# EAGLE design zdrive (EAGLE 9.6.2)
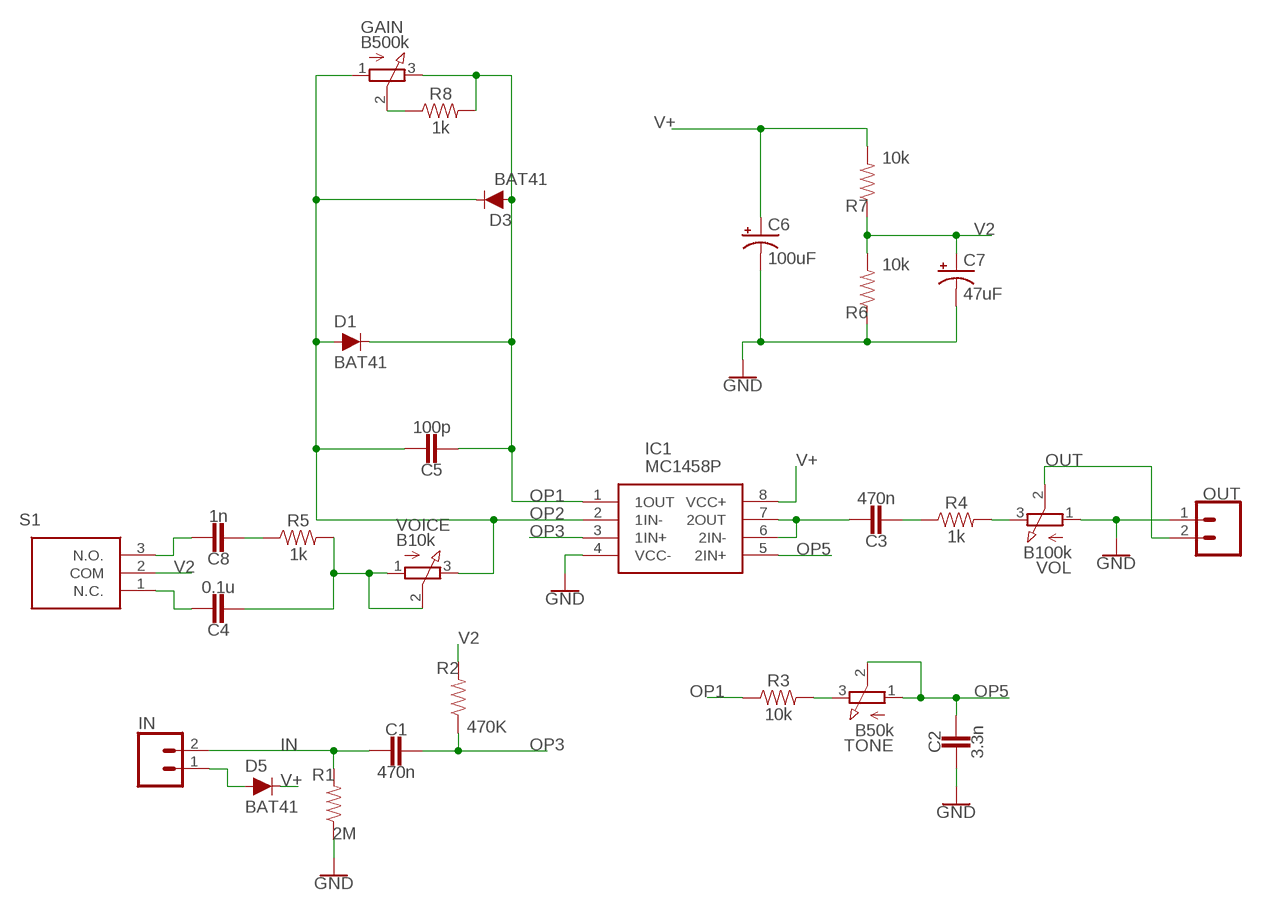
[diagram p0: schematic, sheet 1]

## Parts
C1  470n  CAP.5  [.33UF+]
C2  3.3n  CAP.5  [.33UF+]
C3  470n  CAP.5  [.33UF+]
C4  0.1u  CAP.5  [.33UF+]
C5  100p  CAP.5  [.33UF+]
C6  100uF  100UF-POLAR-RADIAL-2.5MM-25V-20%  [CPOL-RADIAL-2.5MM-6.5MM]
C7  47uF  47UF-POLAR-RADIAL-2.5MM-25V-20%  [CPOL-RADIAL-2.5MM-6.5MM]
C8  1n  CAP.5  [.33UF+]
D1  BAT41  DIODE-KIT2  [DIODE-1N4001-KIT]
D3  BAT41  DIODE-KIT2  [DIODE-1N4001-KIT]
D5  BAT41  DIODE-KIT2  [DIODE-1N4001-KIT]
GAIN  B500k  16MMPOT  [3RP/1610N]
IC1  MC1458P  [DIP794W53P254L959H508Q8N]
IN  CONN_02  [1X02]
OUT  CONN_02  [1X02]
R1  2M  2MOHM-HORIZ-1/4W-5%  [AXIAL-0.3]
R2  470K  470K-HORIZ-1/4W-5%  [AXIAL-0.3]
R3  10k  10KOHM-HORIZ-1/4W-5%  [AXIAL-0.3]
R4  1k  1KOHM-HORIZ-1/4W-5%  [AXIAL-0.3]
R5  1k  1KOHM-HORIZ-1/4W-5%  [AXIAL-0.3]
R6  10k  10KOHM-HORIZ-1/4W-5%  [AXIAL-0.3]
R7  10k  10KOHM-HORIZ-1/4W-5%  [AXIAL-0.3]
R8  1k  1KOHM-HORIZ-1/4W-5%  [AXIAL-0.3]
S1  100SP1T1B2M2QE  [100SP1T1B4M2QE]
TONE  B50k  16MMPOT  [3RP/1610N]
VOICE  B10k  16MMPOT  [3RP/1610N]
VOL  B100k  16MMPOT  [3RP/1610N]

## Nets
9V: D5.A IN.1
GND: C2.2 C6.2(-) C7.2(-) IC1.4(VCC-) OUT.1 R1.P$1 R6.P$1 VOL.1(A)
IN: C1.2 IN.2 R1.P$2
N$1: R3.P$2 TONE.3(E)
N$2: C3.1 IC1.6(2IN-) IC1.7(2OUT)
N$3: C3.2 R4.P$1
N$4: R4.P$2 VOL.3(E)
N$5: GAIN.2(S) R8.P$1
N$6: C8.2 R5.P$1
N$11: C4.1 S1.1(N.C.)
N$12: C8.1 S1.3(N.O.)
N$13: C4.2 R5.P$2 VOICE.1(A) VOICE.2(S)
OP1: C5.2 D1.C D3.A GAIN.3(E) IC1.1(1OUT) R3.P$1 R8.P$2
OP2: C5.1 D1.A D3.C GAIN.1(A) IC1.2(1IN-) VOICE.3(E)
OP3: C1.1 IC1.3(1IN+) R2.P$1
OP5: C2.1 IC1.5(2IN+) TONE.1(A) TONE.2(S)
OUT: OUT.2 VOL.2(S)
V2: C7.1(+) R2.P$2 R6.P$2 R7.P$1 S1.2(COM)
V+: C6.1(+) D5.C IC1.8(VCC+) R7.P$2

## Library data of the parts
C1-C5 C8 = capacitors-film:CAP: For Ceramic, Film, MLCC caps
C6 = SparkFun-Capacitors:100UF-POLAR: 100µF polarized capacitors A capacitor is a passive two-terminal electrical component used to store electrical energy temporarily in an electric field.; PROD_ID: CAP-08439
C7 = Custom-Parts:47UF-POLAR: 47µF polarized capacitors A capacitor is a passive two-terminal electrical component used to store electrical energy temporarily in an electric field.; PROD_ID: CAP-08439
D1 D3 D5 = SparkFun-DiscreteSemi:DIODE: Diode These are standard reverse protection diodes and small signal diodes. SparkFun Products: SparkFun SparkPunk Sound Kit <https://www.sparkfun.com/products/11177> SparkFun ESP8266 Thing <https://www.sparkfun.com/products/13231>; PROD_ID: DIO-09176; VALUE: 1A/50V/1.1V
GAIN TONE VOICE VOL = Custom-Parts:16MMPOT: 16mm Potentiometer one level Source: http://www.alphapotentiometers.net/html/16mm_pot_2.html
IC1 = SamacSys_Parts:MC1458P: General usage dual op-amp,MC1458P DIP8 Texas Instruments MC1458P, Dual Op Amp, 1MHz, 8-Pin PDIP Source: Datasheet <http://www.ti.com/lit/ds/symlink/mc1458.pdf>; DESCRIPTION: General usage dual op-amp,MC1458P DIP8 Texas Instruments MC1458P, Dual Op Amp, 1MHz, 8-Pin PDIP; HEIGHT: 5.08mm; MANUFACTURER_NAME: Texas Instruments; MANUFACTURER_PART_NUMBER: MC1458P; MOUSER_PART_NUMBER: 595-MC1458P; MOUSER_PRICE-STOCK: https://www.mouser.co.uk/ProductDetail/Texas-Instruments/MC1458P?qs=YhsVCygOPE1MedllaWxE%252BA%3D%3D
IN OUT = SparkFun-Connectors:CONN_02: Multi connection point. Often used as Generic Header-pin footprint for 0.1 inch spaced/style header connections On any of the 0.1 inch spaced packages, you can populate with these: Break Away Headers - Straight <https://www.sparkfun.com/products/116> (PRT-00116) Break Away Male Headers - Right Angle <https://www.sparkfun.com/products/553> (PRT-00553) Female Headers <https://www.sparkfun.com/products/115> (PRT-00115) Break Away Headers - Machine Pin <https://www.sparkfun.com/products/117> (PRT-00117) Break Away Female Headers - Swiss Machine Pin <https://www.sparkfun.com/products/743> (PRT-00743) For SCREWTERMINALS and SPRING TERMINALS visit here: Screw Terimnals on SparkFun.com <https://www.sparkfun.com/search/results?term=Screw+Terminals> (5mm/3.5mm/2.54mm spacing) This device is also useful as a general connection point to wire up your design to another part of your project. Our various solder wires solder well into these plated through hole pads. Hook-Up Wire - Assortment (Stranded, 22 AWG) <https://www.sparkfun.com/products/11375> (PRT-11375) Hook-Up Wire - Assortment (Solid Core, 22 AWG) <https://www.sparkfun.com/products/11367> (PRT-11367) View the entire wire category on our website here <https://www.sparkfun.com/categories/141> Special notes: Molex polarized connector foot print use with: PRT-08233 with associated crimp pins and housings. 2.54_SCREWTERM for use with PRT-10571. 3.5mm Screw Terminal footprints for PRT-08084 5mm Screw Terminal footprints for use with PRT-08432
R1 = Custom-Parts:2MOHM: 2MΩ resistor A resistor is a passive two-terminal electrical component that implements electrical resistance as a circuit element. Resistors act to reduce current flow, and, at the same time, act to lower voltage levels within circuits. - Wikipedia; PROD_ID: RES-09329
R2 = Custom-Parts:470K: 470KΩ resistor A resistor is a passive two-terminal electrical component that implements electrical resistance as a circuit element. Resistors act to reduce current flow, and, at the same time, act to lower voltage levels within circuits. - Wikipedia; PROD_ID: RES-09329
R3 R6 R7 = SparkFun-Resistors:10KOHM: 10kΩ resistor A resistor is a passive two-terminal electrical component that implements electrical resistance as a circuit element. Resistors act to reduce current flow, and, at the same time, act to lower voltage levels within circuits. - Wikipedia; PROD_ID: RES-09435
R4 R5 R8 = SparkFun-Resistors:1KOHM: 1kΩ resistor A resistor is a passive two-terminal electrical component that implements electrical resistance as a circuit element. Resistors act to reduce current flow, and, at the same time, act to lower voltage levels within circuits. - Wikipedia; PROD_ID: RES-08380
S1 = SamacSys_Parts:100SP1T1B2M2QE: Toggle Switches 5A 120VAC/28VDC On-None-On PC Mnt Source: Datasheet <https://www.e-switch.com/system/asset/product_line/data_sheet/129/100.pdf>; DESCRIPTION: Toggle Switches 5A 120VAC/28VDC On-None-On PC Mnt; HEIGHT: 28mm; MANUFACTURER_NAME: E-Switch; MANUFACTURER_PART_NUMBER: 100SP1T1B2M2QE; MOUSER_PART_NUMBER: 612-100SP1T1B2M2QE; MOUSER_PRICE-STOCK: https://www.mouser.co.uk/ProductDetail/E-Switch/100SP1T1B2M2QE?qs=f57gQzlyLipVPLzNFzaEDQ%3D%3D

## Board
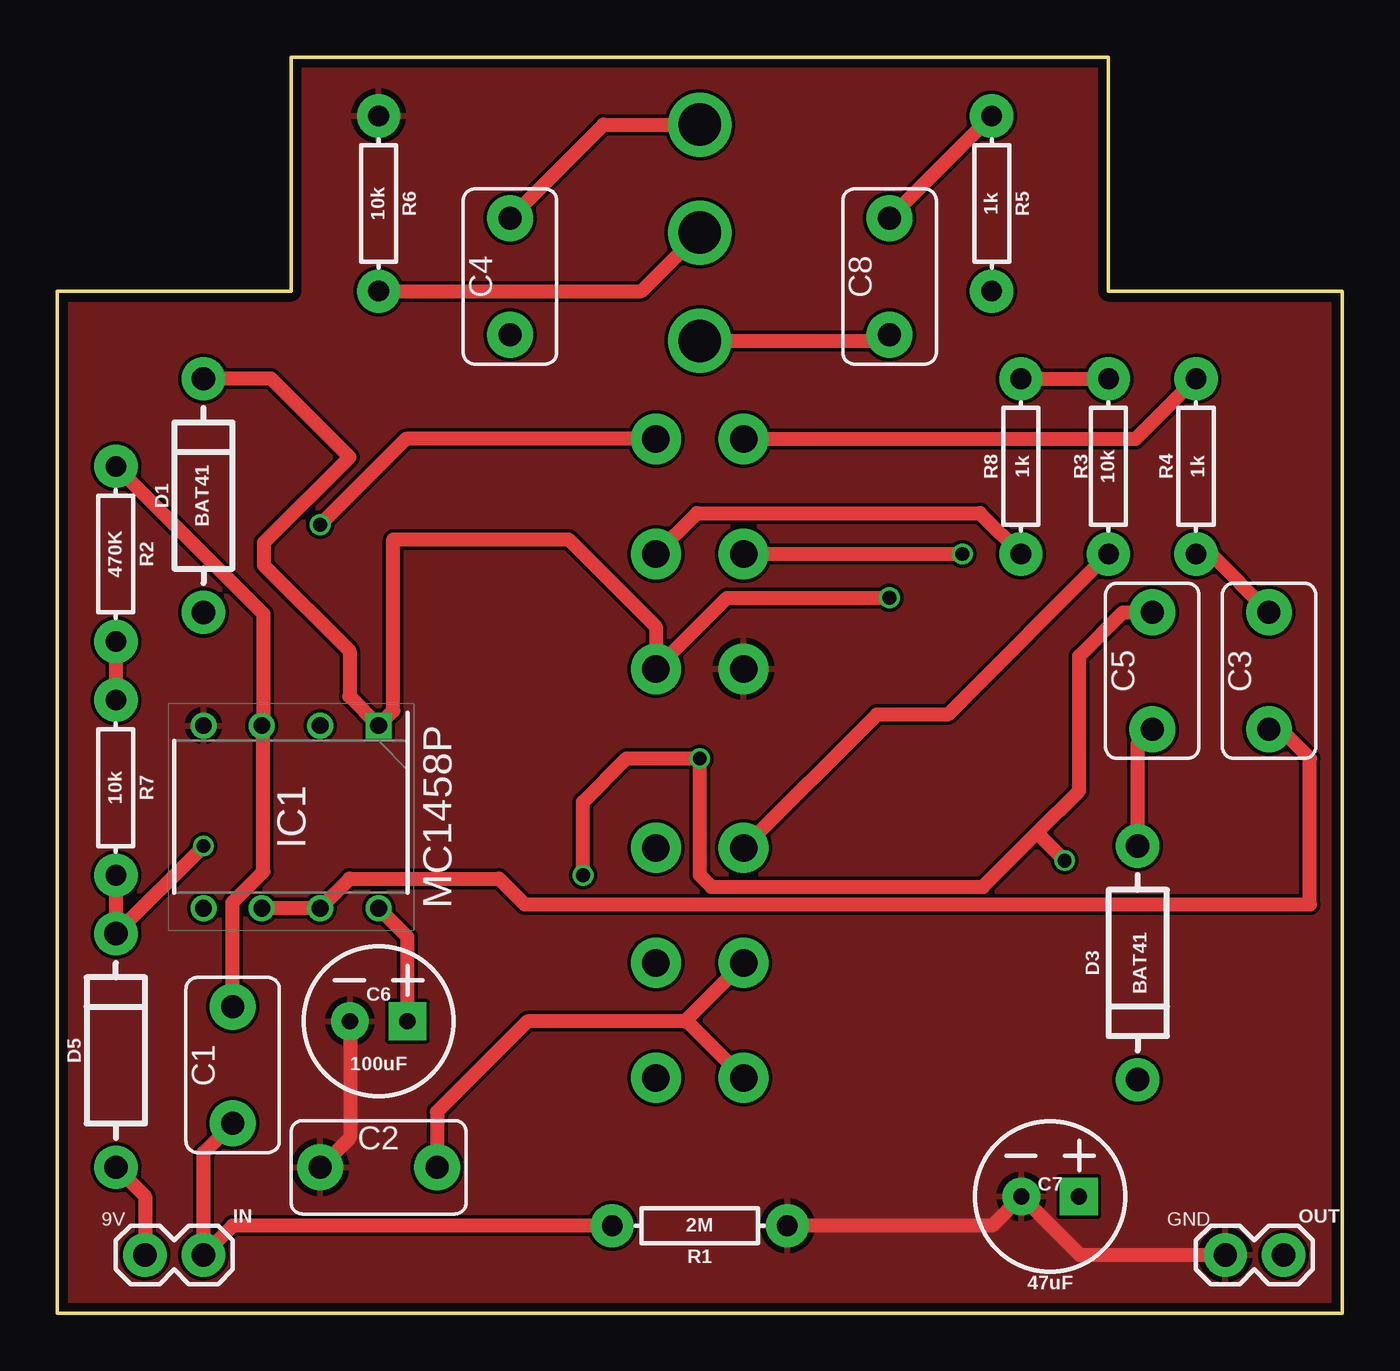
[diagram p1: board, top side]
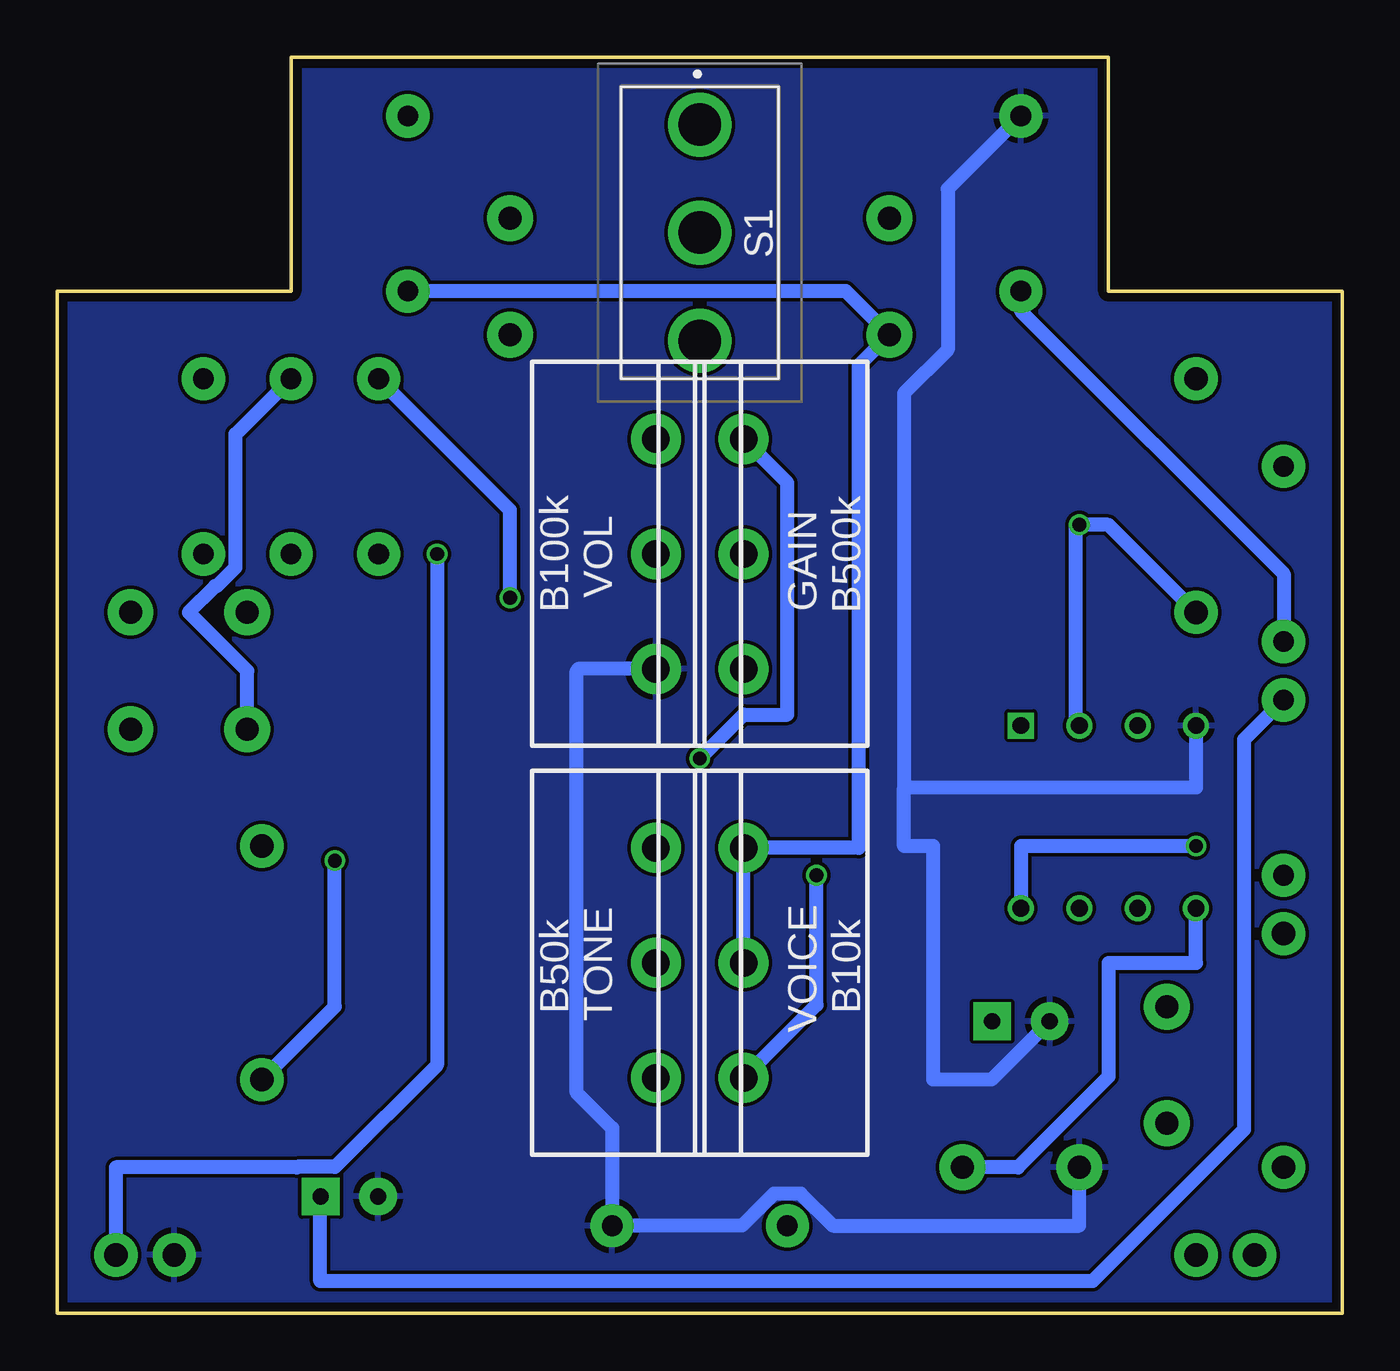
[diagram p2: board, bottom side, seen from below]

Size 55.88 x 54.61 mm. Coordinates in mm from the lower left corner, seen from the top.
Outline: 0,44.45 10.16,44.45 10.16,54.61 45.72,54.61 45.72,44.45 55.88,44.45 55.88,0 0,0 0,44.45
Copper layers (1*16): Top 0.035559375mm / dielectric 1.6mm / Bottom 0.035559375mm
Design rules "oshpark-2layer": minimum track width 6mil, minimum drill 10mil, track to track 6mil, track to pad 6mil, pad to pad 6mil, via to via 6mil, smd to smd 6mil, copper to edge 15mil, drill to drill 6mil, minimum pad ring 5mil, minimum via ring 5mil, stop-mask expansion 2.5mil, vias tented up to drill 0mil, thermal gap 10mil

### Footprints (pad centres in the part's own frame; a part is rotated, then mirrored left to right if it is on the bottom)
.33UF+ = drill 1 pad 2: 1 -2.54,0; 2 2.54,0
CPOL-RADIAL-2.5MM-6.5MM = drill 0.7 pad 1.651 square: 1 1.25,0 | drill 0.7 pad 1.651: 2 -1.25,0
DIODE-1N4001-KIT = drill 1.016 pad 1.88: A -5.08,0; C 5.08,0
3RP/1610N = drill 1.2 pad 2.184: 1 -5,0; 2 0,0; 3 5,0
DIP794W53P254L959H508Q8N = drill 0.73 pad 1.13 square: 1 -3.97,3.81 | drill 0.73 pad 1.13: 2 -3.97,1.27; 3 -3.97,-1.27; 4 -3.97,-3.81; 5 3.97,-3.81; 6 3.97,-1.27; 7 3.97,1.27; 8 3.97,3.81
1X02 = drill 1.016 pad 1.88: 1 0,0; 2 2.54,0
AXIAL-0.3 = drill 0.9 pad 1.88: P$1 -3.81,0; P$2 3.81,0
100SP1T1B4M2QE = drill 1.85 pad 2.775: 1 -4.7,0; 2 0,0; 3 4.7,0

### Placement (x,y rotation side)
C1  7.62,10.79 270 top
C2  13.97,6.35 180 top
C3  52.7,27.94 90 top
C4  19.68,45.09 270 top
C5  47.62,27.94 270 top
C6  13.97,12.7 0 top
C7  43.18,5.08 0 top
C8  36.2,45.09 90 top
D1  6.35,35.56 90 top
D3  46.99,15.24 270 top
D5  2.54,11.43 90 top
GAIN  26.04,33.02 270 bottom
IC1  10.16,21.59 270 top
IN  3.81,2.54 0 top
OUT  50.8,2.54 0 top
R1  27.94,3.81 180 top
R2  2.54,33.02 270 top
R3  45.72,36.83 270 top
R4  49.53,36.83 90 top
R5  40.64,48.26 270 top
R6  13.97,48.26 270 top
R7  2.54,22.86 270 top
R8  41.91,36.83 90 top
S1  27.94,46.99 270 bottom
TONE  29.84,15.24 90 bottom
VOICE  26.04,15.24 270 bottom
VOL  29.84,33.02 90 bottom

### Tracks (layer width: path | path; a pad name or v marks a point on that pad's centre or on a via)
9V
  Top 0.61: D5.A 3.81,5.08 IN.1
GND
  Top 0.61: OUT.1 44.47,2.54 C7.2 40.66,3.81 R1.P$1 | C2.2 12.72,7.64 C6.2
  Bottom 0.61: C6.2 15.26,10.16 17.78,10.16 17.78,20.32 19.05,20.32 19.05,22.86 | IC1.4 6.35,22.86 19.05,22.86 | R6.P$1 17.14,48.9 17.14,41.91 19.05,40.01 19.05,22.86 | VOL.1 33.22,28.02 33.3,27.94 33.3,9.6 31.75,8.05 R1.P$1 26.11,3.81 24.71,5.21 23.55,5.21 22.15,3.81 11.43,3.81 C2.2
  pour Bottom: 0,0 0,44.45 10.16,44.45 10.16,54.61 45.72,54.61 45.72,44.45 55.88,44.45 55.88,0
  pour Top: 0,0 0,44.45 10.16,44.45 10.16,54.61 45.72,54.61 45.72,44.45 55.88,44.45 55.88,0
IN
  Top 0.61: R1.P$2 7.62,3.81 IN.2 6.35,6.99 C1.2
N$1
  Top 0.61: TONE.3 35.64,26.04 38.73,26.04 R3.P$2
N$2
  Top 0.152: IC1.6 9.14,17.68 10.97,17.68 IC1.7 11.48,17.64
  Top 0.61: IC1.6 8.91,17.64 11.48,17.64 | IC1.7 12.71,18.9 19.2,18.9 20.32,17.78 54.48,17.78 54.48,24.13 53.21,25.4 C3.1
N$3
  Top 0.61: R4.P$1 50.16,33.02 C3.2
N$4
  Top 0.61: VOL.3 46.91,38.02 R4.P$2
N$5
  Top 0.61: GAIN.2 27.81,34.8 40.13,34.8 R8.P$1
N$6
  Top 0.61: R5.P$1 C8.2
N$11
  Top 0.61: C4.1 23.75,51.69 S1.1
N$12
  Top 0.61: S1.3 35.94,42.29 C8.1
N$13
  Bottom 0.61: VOICE.2 VOICE.1 21.04,20.24 21.04,41.2 C4.2 21.59,44.45 R5.P$2
OP1  (via drill 0.6)
  Top 0.61: R8.P$2 R3.P$1 | v36.2,31.11 29.13,31.11 GAIN.3 26.04,29.84 22.23,33.66 14.61,33.66 14.61,26.2 IC1.1 12.7,26.83 12.7,28.81 8.98,32.53 8.98,33.51 12.7,37.23 9.29,40.64 D1.C | D3.A 46.99,24.77 C5.2
  Bottom 0.61: R3.P$1 48.13,38.23 48.13,32.44 48.95,31.62 49.02,31.62 50.16,30.48 47.62,27.94 C5.2 | v36.2,31.11 36.2,34.92 R8.P$2
OP2  (via drill 0.6)
  Top 0.61: GAIN.1 15.16,38.02 v11.43,34.29 | v22.86,19.05 22.86,22.23 24.77,24.13 v27.94,24.13 27.94,19.05 28.45,18.54 40.26,18.54 42.61,20.89 | 42.61,20.89 44.45,22.73 44.45,28.57 46.35,30.48 C5.1 | v43.81,19.68 42.61,20.89
  Bottom 0.152: IC1.2 11.58,25.6
  Bottom 0.61: v27.94,24.13 26.04,26.04 24.13,26.04 24.13,36.12 GAIN.1 | VOICE.3 22.86,13.41 v22.86,19.05 | D1.A 10.16,34.29 v11.43,34.29 11.58,34.14 11.58,25.6 | D3.C 43.81,13.34 v43.81,19.68
OP3
  Top 0.152: 8.95,25.43 IC1.3
  Top 0.61: R2.P$1 8.95,30.42 8.95,25.43 8.95,19.2 7.62,17.87 C1.1
OP5
  Top 0.61: 27.3,12.7 20.45,12.7 16.51,8.76 C2.1 | 27.3,12.7 TONE.2 | 27.3,12.7 27.39,12.7 TONE.1
  Bottom 0.61: IC1.5 6.35,15.24 10.16,15.24 10.16,10.29 14.1,6.35 C2.1
OUT  (via drill 0.6)
  Top 0.61: VOL.2 v39.37,33.02
  Bottom 0.61: OUT.2 53.34,6.35 45.46,6.35 45.45,6.36 43.8,6.36 39.37,10.79 v39.37,33.02
V2
  Top 0.61: R2.P$2 R7.P$1 | R6.P$2 25.4,44.45 S1.2
  Bottom 0.61: C7.1 44.45,5.06 44.45,1.4 10.86,1.4 4.27,7.99 4.27,24.94 R7.P$1 | R6.P$2 13.97,43.58 2.54,32.15 R2.P$2
V+  (via drill 0.6)
  Top 0.61: R7.P$2 D5.C v6.35,20.32 | IC1.8 15.22,16.37 C6.1
  Bottom 0.61: v6.35,20.32 13.97,20.32 IC1.8

### Text on the board
tNames: 9V | GND
tValues: IN4007